# EAGLE design 282_Universal_Verteilerplatine_ALF_v1.0_2023-02_28 (EAGLE 9.6.2)
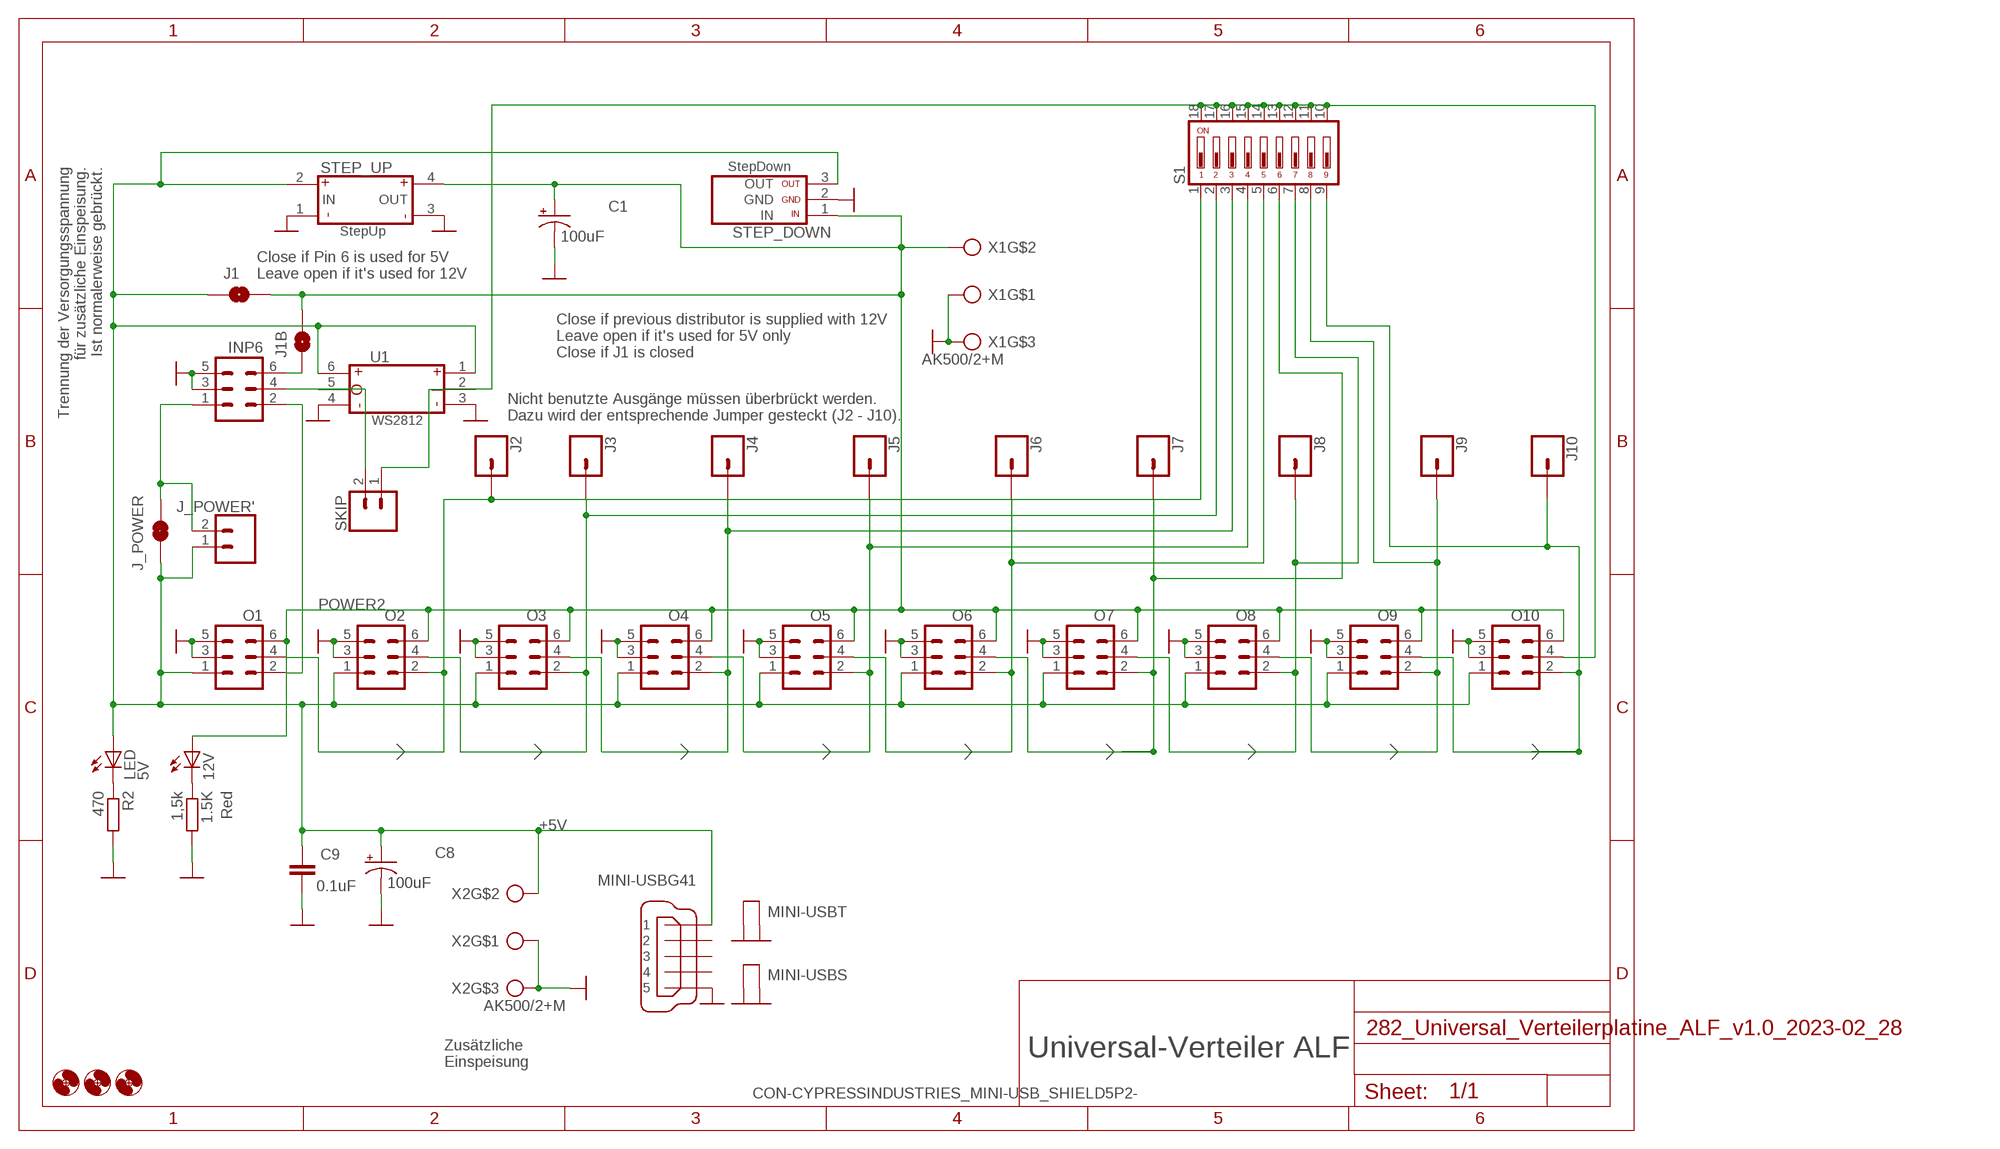
[diagram p0: schematic, sheet 1]

## Parts
1.5K  1,5k  RCL_R-EU_0207/7  [RCL_0207/7]
12V  Red  LED_LED3MM  [LED_LED3MM]
C1  100uF  SPARKFUN-CAPACITORS_100UF-25V-20%(PTH)  [SPARKFUN-CAPACITORS_CPOL-RADIAL-100UF-25V]
C8  100uF  SPARKFUN-CAPACITORS_100UF-25V-20%(PTH)  [SPARKFUN-CAPACITORS_CPOL-RADIAL-100UF-25V]
C9  0.1uF  C-EU025-025X050  [C025-025X050]
H5  MOUNT-HOLE3.0  [3,0]
H6  MOUNT-HOLE3.0  [3,0]
H8  MOUNT-HOLE3.0  [3,0]
INP6  ML6  [ML6]
J1  SOLDERJUMPERNO  [SJ_2S-NO]
J1B  SOLDERJUMPERNO  [SJ_2S-NO]
J2  CONN_01_NO_BORDER  [1X01_NO_BORDER]
J3  CONN_01_NO_BORDER  [1X01_NO_BORDER]
J4  CONN_01_NO_BORDER  [1X01_NO_BORDER]
J5  CONN_01_NO_BORDER  [1X01_NO_BORDER]
J6  CONN_01_NO_BORDER  [1X01_NO_BORDER]
J7  CONN_01_NO_BORDER  [1X01_NO_BORDER]
J8  CONN_01_NO_BORDER  [1X01_NO_BORDER]
J9  CONN_01_NO_BORDER  [1X01_NO_BORDER]
J10  CONN_01_NO_BORDER  [1X01_NO_BORDER]
J_POWER  SOLDERJUMPERNO  [SJ_2S-NO]
J_POWER'  CONN_02  [1X02]
LED  5V  LED_LED3MM  [LED_LED3MM]
MINI-USB  CON-CYPRESSINDUSTRIES_MINI-USB_SHIELD5P2-  [MINI_USB_MULTI]
O1  ML6  [ML6]
O2  ML6  [ML6]
O3  ML6  [ML6]
O4  ML6  [ML6]
O5  ML6  [ML6]
O6  ML6  [ML6]
O7  ML6  [ML6]
O8  ML6  [ML6]
O9  ML6  [ML6]
O10  ML6  [ML6]
R2  470  RCL_R-EU_0207/7  [RCL_0207/7]
S1  DIP09YL  [DIP09YL]
SKIP  CONN_02  [1X02]
STEP_DOWN  STEP_DOWN  [MINI_STEP_DOWN]
STEP_UP  STEP_UP  [MINI_STEP_UP]
U1  WS2812_BREAKOUTCUT  [WS2812__BREAKOUT_CUT]
X1  AK500/2+M  [AK500/2+M]
X2  AK500/2+M  [AK500/2+M]

## Nets
5V: C8.1(+) C9.2 J1.1 J_POWER'.1 J_POWER.1 LED.A MINI-USB.1 O1.1 O2.1 O3.1 O4.1 O5.1 O6.1 O7.1 O8.1 O9.1 O10.1 STEP_DOWN.3(VDD_OUT) STEP_UP.2(VDD_IN) U1.1(VDD1) U1.6(VDD) X2.2
GND: 1.5K.2 C1.2(-) C8.2(-) C9.1 INP6.3 INP6.5 MINI-USB.5 MINI-USB.M1(S:S1) MINI-USB.M2(S:S2) MINI-USB.M3(T:S1) MINI-USB.M4(T:S2) O1.3 O1.5 O2.3 O2.5 O3.3 O3.5 O4.3 O4.5 O5.3 O5.5 O6.3 O6.5 O7.3 O7.5 O8.3 O8.5 O9.3 O9.5 O10.3 O10.5 R2.2 STEP_DOWN.2(GND) STEP_UP.1(GND_IN) STEP_UP.3(GND_OUT) U1.3(GND1) U1.4(GND) X1.1 X1.M X2.1 X2.M
N$1: 1.5K.1 12V.K(C)
N$2: J7.1 O6.4 O7.2 S1.6
N$3: INP6.2 O1.2
N$4: J8.1 O7.4 O8.2 S1.7
N$5: INP6.6 J1B.1
N$6: INP6.4 SKIP.2 U1.5(DO)
N$7: O10.4 S1.10 S1.11 S1.12 S1.13 S1.14 S1.15 S1.16 S1.17 S1.18 SKIP.1 U1.2(DIN)
N$8: J2.1 O1.4 O2.2 S1.1
N$9: INP6.1 J_POWER'.2 J_POWER.2
N$10: J10.1 O9.4 O10.2 S1.9
N$11: J3.1 O2.4 O3.2 S1.2
N$16: LED.K(C) R2.1
N$47: J4.1 O3.4 O4.2 S1.3
N$50: J5.1 O4.4 O5.2 S1.4
N$51: J6.1 O5.4 O6.2 S1.5
N$57: J9.1 O8.4 O9.2 S1.8
POWER2: 12V.A C1.1(+) J1.2 J1B.2 O1.6 O2.6 O3.6 O4.6 O5.6 O6.6 O7.6 O8.6 O9.6 O10.6 STEP_DOWN.1(VDD_IN) STEP_UP.4(VDD_OUT) X1.2
Unconnected: MINI-USB.2 MINI-USB.3 MINI-USB.4

## Notes on the sheet
- Trennung der Versorgungsspannung
  für zusätzliche Einspeisung.
  Ist normalerweise gebrückt.
- Close if Pin 6 is used for 5V
  Leave open if it's used for 12V
- Close if previous distributor is supplied with 12V
  Leave open if it's used for 5V only
  Close if J1 is closed
- Nicht benutzte Ausgänge müssen überbrückt werden.
  Dazu wird der entsprechende Jumper gesteckt (J2 - J10).
- +5V
- Zusätzliche
  Einspeisung
- Universal-Verteiler ALF

## Library data of the parts
1.5K R2 = Sound_MP3-TF-16P_and_WS2811:RCL_R-EU_: RESISTOR, European symbol; SPICEPREFIX: R
12V LED = Sound_MP3-TF-16P_and_WS2811:LED_LED: LED OSRAM: - CHIPLED LG R971, LG N971, LY N971, LG Q971, LY Q971, LO R971, LY R971 LH N974, LH R974 LS Q976, LO Q976, LY Q976 LO Q996 - Hyper CHIPLED LW Q18S LB Q993, LB Q99A, LB R99A - SideLED LS A670, LO A670, LY A670, LG A670, LP A670 LB A673, LV A673, LT A673, LW A673 LH A674 LY A675 LS A676, LA A676, LO A676, LY A676, LW A676 LS A679, LY A679, LG A679 - Hyper Micro SIDELED® LS Y876, LA Y876, LO Y876, LY Y876 LT Y87S - SmartLED LW L88C, LW L88S LB L89C, LB L89S, LG L890 LS L89K, LO L89K, LY L89K LS L896, LA L896, LO L896, LY L896 - TOPLED LS T670, LO T670, LY T670, LG T670, LP T670 LSG T670, LSP T670, LSY T670, LOP T670, LYG T670 LG T671, LOG T671, LSG T671 LB T673, LV T673, LT T673, LW T673 LH T674 LS T676, LA T676, LO T676, LY T676, LB T676, LH T676, LSB T676, LW T676 LB T67C, LV T67C, LT T67C, LS T67K, LO T67K, LY T67K, LW E67C LS E67B, LA E67B, LO E67B, LY E67B, LB E67C, LV E67C, LT E67C LW T67C LS T679, LY T679, LG T679 LS T770, LO T770, LY T770, LG T770, LP T770 LB T773, LV T773, LT T773, LW T773 LH T774 LS E675, LA E675, LY E675, LS T675 LS T776, LA T776, LO T776, LY T776, LB T776 LHGB T686 LT T68C, LB T68C - Hyper Mini TOPLED® LB M676 - Mini TOPLED Santana® LG M470 LS M47K, LO M47K, LY M47K Source: http://www.osram.convergy.de LUXEON: - LUMILED® LXK2-PW12-R00, LXK2-PW12-S00, LXK2-PW14-U00, LXK2-PW14-V00 LXK2-PM12-R00, LXK2-PM12-S00, LXK2-PM14-U00 LXK2-PE12-Q00, LXK2-PE12-R00, LXK2-PE12-S00, LXK2-PE14-T00, LXK2-PE14-U00 LXK2-PB12-K00, LXK2-PB12-L00, LXK2-PB12-M00, LXK2-PB14-N00, LXK2-PB14-P00, LXK2-PB14-Q00 LXK2-PR12-L00, LXK2-PR12-M00, LXK2-PR14-Q00, LXK2-PR14-R00 LXK2-PD12-Q00, LXK2-PD12-R00, LXK2-PD12-S00 LXK2-PH12-R00, LXK2-PH12-S00 LXK2-PL12-P00, LXK2-PL12-Q00, LXK2-PL12-R00 Source: www.luxeon.com KINGBRIGHT: KA-3528ASYC Source: www.kingbright.com
C1 C8 = Sound_MP3-TF-16P_and_WS2811:SPARKFUN-CAPACITORS_100UF-25V-20%(PTH): CAP-08439; PROD_ID: CAP-08439
C9 = rcl:C-EU: CAPACITOR, European symbol; SPICEPREFIX: C
H5 H6 H8 = holes:MOUNT-HOLE: MOUNTING HOLE with drill center marker
INP6 O1-O10 = con-harting-ml:ML6: HARTING; OC_FARNELL: unknown; OC_NEWARK: unknown
J1 J1B J_POWER = SparkFun-Retired:SOLDERJUMPER: Solder Jumper Standard SMD solder jumper. Used to automate production. Two varients : Normally Open and Normally Closed are the same, but have different paste layers. NC will have a large amount of paste and should jumper during reflow.
J2-J10 = SparkFun-Connectors:CONN_01: Single connection point. Often used as Generic Header-pin footprint for 0.1 inch spaced/style header connections On any of the 0.1 inch spaced packages, you can populate with these: Break Away Headers - Straight <https://www.sparkfun.com/products/116> (PRT-00116) Break Away Male Headers - Right Angle <https://www.sparkfun.com/products/553> (PRT-00553) Female Headers <https://www.sparkfun.com/products/115> (PRT-00115) Break Away Headers - Machine Pin <https://www.sparkfun.com/products/117> (PRT-00117) Break Away Female Headers - Swiss Machine Pin <https://www.sparkfun.com/products/743> (PRT-00743) This device is also useful as a general connection point to wire up your design to another part of your project. Our various solder wires solder well into these plated through hole pads. Hook-Up Wire - Assortment (Stranded, 22 AWG) <https://www.sparkfun.com/products/11375> (PRT-11375) Hook-Up Wire - Assortment (Solid Core, 22 AWG) <https://www.sparkfun.com/products/11367> (PRT-11367) View the entire wire category on our website here <https://www.sparkfun.com/categories/141> Special notes: SMTSO-256-ET is a "flush mount" nut for a 4-40 screw. We mostly use this on specialty testbeds; it is a nice way to connect hardware to your PCB at an adjustable hieght. Also note, the SNAP packages are for using a snappable style connector. We sell a baggie of snaps and they are also used on two LilyPad designs: Snap Assortment - 30 pack (male and female) <https://www.sparkfun.com/products/11347> (DEV-11347) LilyPad Arduino SimpleSnap <https://www.sparkfun.com/products/10941> (DEV-10941) LilyPad SimpleSnap Protoboard <https://www.sparkfun.com/products/10940> (DEV-10940)
J_POWER' SKIP = SparkFun-Connectors:CONN_02: Multi connection point. Often used as Generic Header-pin footprint for 0.1 inch spaced/style header connections On any of the 0.1 inch spaced packages, you can populate with these: Break Away Headers - Straight <https://www.sparkfun.com/products/116> (PRT-00116) Break Away Male Headers - Right Angle <https://www.sparkfun.com/products/553> (PRT-00553) Female Headers <https://www.sparkfun.com/products/115> (PRT-00115) Break Away Headers - Machine Pin <https://www.sparkfun.com/products/117> (PRT-00117) Break Away Female Headers - Swiss Machine Pin <https://www.sparkfun.com/products/743> (PRT-00743) For SCREWTERMINALS and SPRING TERMINALS visit here: Screw Terimnals on SparkFun.com <https://www.sparkfun.com/search/results?term=Screw+Terminals> (5mm/3.5mm/2.54mm spacing) This device is also useful as a general connection point to wire up your design to another part of your project. Our various solder wires solder well into these plated through hole pads. Hook-Up Wire - Assortment (Stranded, 22 AWG) <https://www.sparkfun.com/products/11375> (PRT-11375) Hook-Up Wire - Assortment (Solid Core, 22 AWG) <https://www.sparkfun.com/products/11367> (PRT-11367) View the entire wire category on our website here <https://www.sparkfun.com/categories/141> Special notes: Molex polarized connector foot print use with: PRT-08233 with associated crimp pins and housings. 2.54_SCREWTERM for use with PRT-10571. 3.5mm Screw Terminal footprints for PRT-08084 5mm Screw Terminal footprints for use with PRT-08432
MINI-USB = Mini-MLL_Plus_v0.2:CON-CYPRESSINDUSTRIES_MINI-USB_SHIELD5P2-: MINI USB-B R/A DIP 5pol. Source: www.cypressindustries.com
S1 = switch-dil:DIP09YL: DIL/CODE SWITCH; OC_FARNELL: unknown; OC_NEWARK: unknown
STEP_DOWN = Arduino_fuer_LEDs_DCC_2_All:STEP_DOWN
STEP_UP = Arduino_fuer_LEDs_DCC_2_All:STEP_UP
U1 = Arduino_fuer_LEDs_DCC_2_All:WS2812_BREAKOUT: WS2812 Modul mit Winkelsteckern (by Hardi) abgesägt
X1 X2 = Arduino_fuer_LEDs_DCC_2:AK500/2+M

## Board
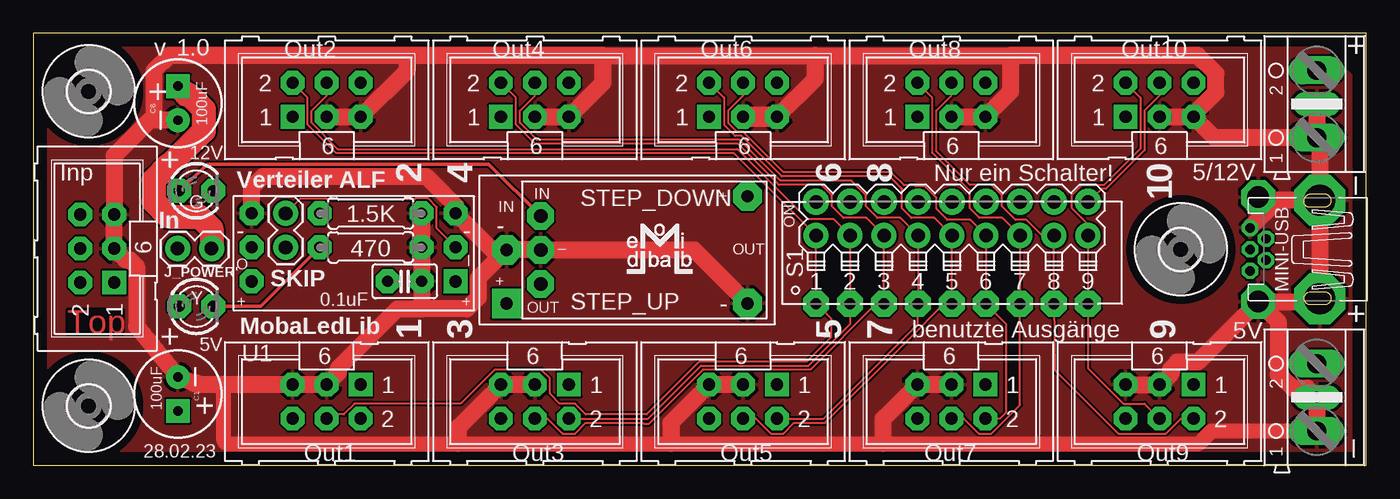
[diagram p1: board, top side]
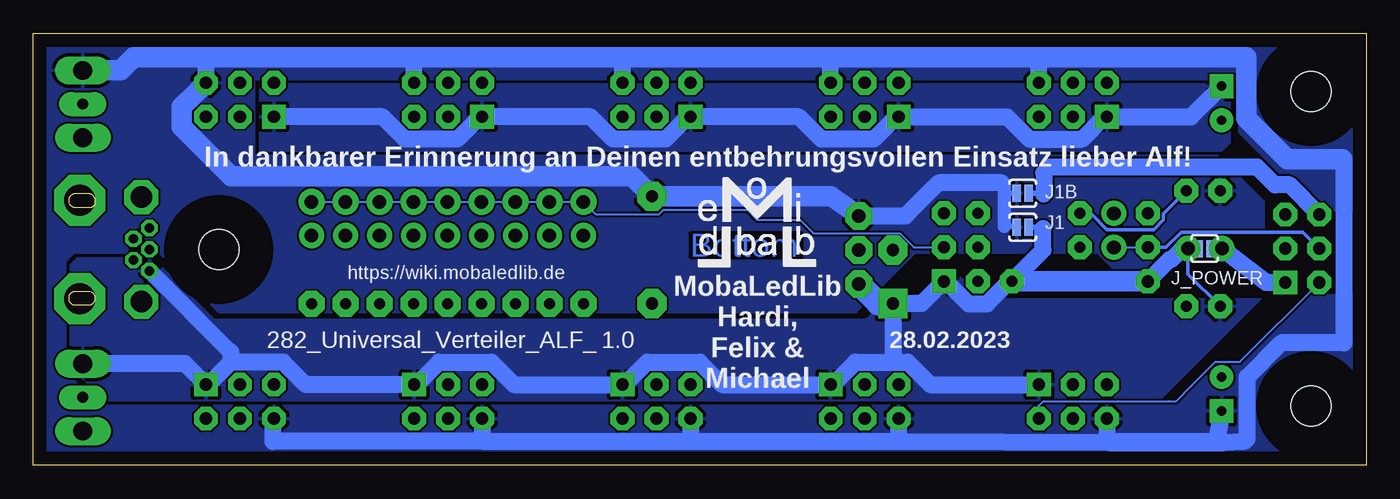
[diagram p2: board, bottom side, seen from below]

Size 99.57 x 32.26 mm. Coordinates in mm from the lower left corner, seen from the top.
Outline: 0,0 99.57,0 99.57,32.26 0,32.26 0,0
Copper layers (1*16): Top 0.035mm / dielectric 1.5mm / Bottom 0.035mm
Design rules "default *": minimum track width 6mil, minimum drill 0.35mm, track to track 6mil, track to pad 6mil, pad to pad 6mil, via to via 6mil, smd to smd 6mil, copper to edge 40mil, drill to drill 6mil, minimum pad ring 10mil, minimum via ring 8mil, stop-mask expansion 4mil, vias tented up to drill 0mil, thermal gap 10mil

### Footprints (pad centres in the part's own frame; a part is rotated, then mirrored left to right if it is on the bottom)
RCL_0207/7 = drill 0.813 pad 1.778 octagon: 1 -3.81,0; 2 3.81,0
LED_LED3MM = drill 0.813 pad 1.778 octagon: A -1.27,0; K 1.27,0
SPARKFUN-CAPACITORS_CPOL-RADIAL-100UF-25V = drill 0.7 pad 1.778 square: 1 1.27,0 | drill 0.7 pad 1.778: 2 -1.27,0
C025-025X050 = drill 0.813 pad 1.778 octagon: 1 -1.27,0; 2 1.27,0
3,0 = hole 3: 0,0
ML6 = drill 0.914 pad 1.778 square: 1 -2.54,-1.27 | drill 0.914 pad 1.778 octagon: 2 -2.54,1.27; 3 0,-1.27; 4 0,1.27; 5 2.54,-1.27; 6 2.54,1.27
SJ_2S-NO = smd 0.635 x 1.27: 1 -0.45,0; 2 0.45,0
1X01_NO_BORDER = drill 1.016 pad 1.88: 1 0,0
1X02 = drill 1.016 pad 1.88: 1 0,0; 2 2.54,0
MINI_USB_MULTI = drill 0.7 pad 1.143 octagon: 1 2.825,1.6; 2 1.625,0.8; 3 2.825,0; 4 1.625,-0.8; 5 2.825,-1.6 | drill 2.3 pad 3.81 octagon: M1 -2.375,3.675; M2 -2.375,-3.675 | drill 1.6 pad 2.54 octagon: M3 2.225,3.9; M4 2.225,-3.9
DIP09YL = drill 0.813 pad 1.93 octagon: 1 -10.16,-3.81; 2 -7.62,-3.81; 3 -5.08,-3.81; 4 -2.54,-3.81; 5 0,-3.81; 6 2.54,-3.81; 7 5.08,-3.81; 8 7.62,-3.81; 9 10.16,-3.81 | drill 1.016 pad 1.93: 10 10.16,3.81; 11 7.62,3.81; 12 5.08,3.81; 13 2.54,3.81; 14 0,3.81; 15 -2.54,3.81; 16 -5.08,3.81; 17 -7.62,3.81; 18 -10.16,3.81
MINI_STEP_DOWN = drill 1.016 pad 2.032 octagon: 1 0,2.54; 2 0,0; 3 0,-2.54
MINI_STEP_UP = drill 0.914 pad 2.184 octagon: 1 0,4; 3 18,0; 4 18,8 | drill 0.914 pad 2.184 square: 2 0,0
WS2812__BREAKOUT_CUT = drill 0.914 pad 1.778 square: 1 -7.62,2.54 | drill 0.914 pad 1.778 octagon: 2 -7.62,0; 3 -7.62,-2.54; 4 7.62,-2.54; 5 7.62,0; 6 7.62,2.54
AK500/2+M = drill 1.397 long: 1 -2.515,0; 2 2.515,0 | drill 0.813 pad 1.778 long: M 0,0

### Placement (x,y rotation side)
1.5K  25.2,18.82 0 top
12V  12.17,20.51 0 top
C1  10.79,5.33 270 top
C8  10.79,27.05 90 top
C9  27.74,13.74 180 top
H5  4.13,27.94 0 top
H6  4.13,4.45 0 top
H8  85.72,16.13 0 top
INP6  4.76,16.19 90 top
J1  25.65,17.78 180 bottom
J1B  25.65,20.32 180 bottom
J2  58.47,17.17 0 top
J3  61.01,17.17 0 top
J4  63.55,17.17 0 top
J5  66.09,17.17 0 top
J6  68.63,17.17 0 top
J7  71.17,17.17 0 top
J8  73.71,17.17 0 top
J9  76.25,17.17 0 top
J10  78.79,17.17 0 top
J_POWER  12.06,16.19 0 bottom
J_POWER'  13.31,16.19 180 top
LED  12.17,11.87 0 top
MINI-USB  93.73,16.13 180 top
O1  21.91,4.76 180 top
O2  21.91,27.3 0 top
O3  37.47,4.76 180 top
O4  37.47,27.3 0 top
O5  53.02,4.76 180 top
O6  53.02,27.3 0 top
O7  68.58,4.76 180 top
O8  68.58,27.3 0 top
O9  84.14,4.76 180 top
O10  84.14,27.3 0 top
R2  25.2,16.28 0 top
S1  68.63,15.88 0 top
SKIP  18.85,18.82 270 top
STEP_DOWN  37.9,16.09 0 top
STEP_UP  35.36,12.09 0 top
U1  23.93,16.28 180 top
X1  95.89,26.99 90 top
X2  95.89,5.08 90 top

### Tracks (layer width: path | path; a pad name or v marks a point on that pad's centre or on a via)
5V
  Top 1.778: C8.1 11.4,27.71 11.6,27.71 12.72,26.58 12.72,24.98 10.19,22.44 10.1,22.44 8.97,21.31 8.97,19.71 10.1,18.58 12.41,18.58 13.31,17.68 J_POWER'.1
  Bottom 0.152: J_POWER.1 J_POWER'.1
  Bottom 0.203: 25.15,17.78 J1.1
  Bottom 0.254: J_POWER'.1 13.31,14.29 LED.A
  Bottom 0.406: 24.13,17.68 24.23,17.78 25.15,17.78
  Bottom 1.219: MINI-USB.1 84.83,8.46
  Bottom 1.27: 84.83,7.71 80.9,7.71 79.23,6.03 O7.1 70.95,6.03 69.27,7.71 65.35,7.71 63.67,6.03 O5.1 55.39,6.03 53.72,7.71 49.79,7.71 48.11,6.03 O3.1 39.84,6.03 38.16,7.71 35.36,7.71 | O1.1 32.55,6.03 34.23,7.71 35.36,7.71 | O10.1 73.49,26.04 71.81,24.36 67.89,24.36 66.21,26.04 O8.1 57.93,26.04 56.26,24.36 52.33,24.36 50.65,26.04 O6.1 42.38,26.04 40.7,24.36 36.77,24.36 35.09,26.04 O4.1 26.82,26.04 25.14,24.36 21.21,24.36 19.54,26.04 O2.1 13.08,26.04 C8.1 | 35.36,7.71 STEP_UP.2 33.2,12.09 U1.1 31.38,13.74 29.7,12.06 28.31,12.06 26.64,13.74 C9.2 | 84.83,8.46 84.83,7.71 | 26.18,13.74 C9.2 | X2.2 88.24,7.59 O9.1 86.51,6.03 84.83,7.71 | C9.2 24.13,16.08 24.13,17.68 | U1.6 14.68,15.37 14.57,15.37 13.74,16.19 J_POWER'.1
  Bottom 1.524: U1.6 26.18,13.74
  Bottom 1.778: STEP_DOWN.3 36.44,12.09 STEP_UP.2
  pour Bottom: 10.16,28.45 82.68,28.45 82.68,23.5 10.79,23.5 10.16,24.13
  pour Bottom: 96.77,14.99 96.27,15.49 90.68,15.49 86.11,10.92 37.34,10.92 35.56,12.7 33.27,12.7 31.24,14.73 30.99,14.73 29.97,13.72 29.97,12.7 29.46,12.19 27.43,12.19 27.18,12.45 7.87,12.45 15.49,4.83 94.23,4.83 96.77,7.37
GND
  Top 0.152: 31.75,1.59 31.75,1.65 | 47.62,1.65 47.62,1.59 | 63.5,1.59 63.5,1.65
  Top 1.118: X2.1 88.01,2.56 87.04,1.59 63.5,1.59 47.62,1.59 31.75,1.59 14.49,1.59 14.22,1.85 14.22,6.03
  Top 1.27: O2.3 O2.5 27.94,29.53 27.94,30.61 | O4.3 O4.5 42.55,28.57 42.55,30.61 | O8.3 O8.5 73.03,27.94 73.03,30.61 | O10.3 O10.5 | O9.5 O9.3 85,6.9 85,7.25 85.46,7.71 86.98,7.71 MINI-USB.M3 | O7.3 O7.5 63.5,3.49 63.5,1.65 | O5.3 O5.5 47.62,3.17 47.62,1.65 | O3.3 O3.5 31.75,2.86 31.75,1.65 | 73.03,30.61 87.02,30.61 88.35,29.27 88.35,27.88 86.68,26.2 O10.5 | 42.55,30.61 27.94,30.61 | STEP_UP.1 STEP_DOWN.2 49.36,16.09 STEP_UP.3 | STEP_UP.1 34.28,16.09 U1.3 31.55,19.38 29.34,21.59 17.14,21.59 16.31,20.75 U1.4 | R2.2 1.5K.2 C9.1 29.01,11.68 | 27.94,30.61 10.13,30.61 8.98,29.47 8.98,26.07 8.7,25.78 | X1.M X1.1 | X1.1 88.24,24.47 O10.5 | X1.1 96.1,24.26 MINI-USB.M2 | MINI-USB.M2 MINI-USB.M1 95.88,12.23 MINI-USB.M3 | MINI-USB.M2 92.98,19.8 | 92.98,19.8 91.73,19.8 MINI-USB.M4 | MINI-USB.5 92.98,19.8 | MINI-USB.M3 93,10.73 93,6.83 94.08,5.76 95.21,5.76 X2.M X2.1 | 42.55,30.61 58.42,30.61 | 58.42,30.61 73.03,30.61 | O6.5 58.42,28.89 58.42,30.61 | 8.7,25.78 6.03,23.11 INP6.5 INP6.3 6.9,15.33 7.25,15.33 7.71,14.87 7.71,10.39 C1.2 11.98,6.12 12.33,6.12 12.42,6.03 14.22,6.03 O1.5 O1.3 22.77,6.9 22.77,7.25 27.21,11.68 29.01,11.68 | C8.2 8.7,25.78 | STEP_UP.1 33.22,13.96 33.22,12.53 32.38,11.68 29.01,11.68
  Top 1.524: O6.3 O6.5
  pour Top: 0,0 0,31.75 0,32.38 95.25,32.38 99.69,27.94 99.69,0
N$1
  Bottom 0.254: 1.5K.1 20.57,18.82 19.35,17.6 15.87,17.6 15.14,18.34 15.14,18.81 12V.K
N$2
  Top 0.152: O6.4 53.02,27.62 51.91,26.5 51.91,25.57 52.56,24.92 53.02,24.92 56.04,21.89 64.08,21.89 65.02,20.95 65.79,20.95 65.86,20.88 66.58,20.88 67.44,20.03 67.44,19.19 68.29,18.34 70,18.34 J7.1 S1.6 72.64,10.59 72.64,3.94 72.2,3.49 O7.2
N$3
  Bottom 0.152: O1.2 24.45,4.45 24.1,4.8 18.54,4.8 | INP6.2 9.42,7.72 11.26,7.72 13.05,5.93 | 18.54,4.8 14.73,4.8 | 14.73,4.8 14.18,4.8 13.05,5.93 | 13.05,5.93 | 14.73,4.8 | 18.54,4.8
N$4
  Top 0.152: O8.2 67.16,27.46 67.16,23.34 69.98,20.52 69.98,19.19 70.68,18.49 72,18.49 72.01,18.49 72.39,18.49 J8.1 S1.7 73.71,4.5 71.58,2.38 70.66,2.38 69.54,3.49 O7.4
N$5
  Bottom 0.203: 24.38,20.32 24.14,20.32 24.09,20.27
  Bottom 0.406: J1B.1 24.38,20.32
  Bottom 1.27: INP6.6 5.71,20.95 6.81,20.95 8.13,22.28 23.65,22.28 24.09,21.84 24.09,20.27
N$6
  Bottom 0.152: SKIP.2 U1.5
  Bottom 0.254: U1.5 14.95,16.28 13.81,17.41 4.71,17.41 INP6.4
N$7
  Top 0.152: O10.4 84.14,27.62 83.02,26.5 83.02,23.53 80.14,20.65 79.82,20.65 S1.10 | U1.2 30.12,17.7 30.12,19.28 29.47,19.94 28.54,19.94 28.52,19.91 21.88,19.91 21.85,19.94 19.96,19.94 SKIP.1
  Bottom 0.152: S1.10 S1.11 S1.12 S1.13 S1.14 S1.15 S1.16 S1.17 S1.18 57.55,18.77 52.81,18.77 52.51,19.07 46.23,19.07 45.5,18.35 42.31,18.35 41.3,17.34 34.84,17.34 33.79,16.28 U1.2
N$8
  Top 0.152: O2.2 20.48,27.46 20.48,25.45 22.61,23.32 52.32,23.32 J2.1 S1.1 59.62,10.96 59.62,9.59 57.79,7.76 49.77,7.76 45.82,3.81 41.27,3.81 40.47,4.61 39.33,4.61 38.58,5.35 38.58,6.5 37.93,7.15 34.46,7.15 31.92,4.61 23.98,4.61 23.18,3.81 22.23,3.81 O1.4
N$9
  Bottom 0.152: J_POWER.2 10.94,16.19 10.93,16.21
  Bottom 0.203: 10.93,16.21 J_POWER'.2
  Bottom 1.27: INP6.1 7.47,13.65 J_POWER'.2
N$10
  Top 0.152: O9.4 83.02,4.61 81.44,4.61 78.79,7.26 S1.9 J10.1 78.79,18 77.6,19.19 77.6,20.18 78.37,20.95 80.01,20.95 82.72,23.66 82.72,27.46 O10.2
N$11
  Top 0.152: O3.2 45.93,3.49 49.89,7.46 57.91,7.46 61.01,10.55 S1.2 J3.1 59.77,18.41 57.8,18.41 52.59,23.62 22.74,23.62 20.79,25.57 20.79,26.5 21.91,27.62 O2.4
N$16
  Top 0.254: LED.K 16.98,11.87 R2.1
N$47
  Top 0.152: O4.2 36.04,27.46 36.04,25.45 37.48,24 52.64,24 55.69,20.95 58.89,20.95 59.66,20.18 59.66,19.34 60.52,18.49 62.23,18.49 J4.1 S1.3 62.95,12.06 58.04,7.15 50.02,7.15 45.99,3.12 45.59,3.12 45.54,3.17 41.27,3.17 40.47,2.38 39.54,2.38 38.42,3.49 O3.4
N$50
  Top 0.152: O5.2 59.03,3.49 65.23,9.7 66.09,10.57 S1.4 J5.1 64.77,18.49 63.06,18.49 62.2,19.34 62.2,20.18 61.12,21.26 55.82,21.26 52.77,24.31 37.61,24.31 36.35,25.57 36.35,26.5 37.47,27.62 O4.4
N$51
  Top 0.152: O6.2 51.6,27.46 51.6,25.45 52.43,24.61 52.89,24.61 55.92,21.59 63.96,21.59 64.9,20.65 64.9,19.19 65.6,18.49 67.31,18.49 J6.1 S1.5 68.55,11.98 67.95,11.98 65.36,9.39 59.14,3.17 56.83,3.17 56.02,2.38 55.1,2.38 53.98,3.49 O5.4
N$57
  Top 0.152: O8.4 68.58,27.62 67.46,26.5 67.46,23.46 69.97,20.95 71.59,20.95 72.36,20.18 72.36,19.34 73.37,18.34 74.19,18.34 75.36,17.17 J9.1 S1.8 76.33,7.11 81.06,2.38 84.6,2.38 85.72,3.49 O9.2
POWER2
  Top 0.254: STEP_DOWN.1 34.02,22.5 13.03,22.5 12V.A
  Bottom 0.406: J1.2 26.18,17.86 27.03,17.86 | J1B.2 27.03,20.32
  Bottom 1.016: 27.03,17.86 27.03,20.32 27.03,20.9 27.23,21.11
  Bottom 1.27: STEP_DOWN.1 34.41,18.63 31.94,21.11 27.23,21.11 | 66.04,1.82 50.16,1.82 | 50.16,1.82 34.92,1.82 | O7.6 66.04,1.82 | O5.6 50.48,2.13 50.16,1.82 | O3.6 34.92,1.82 | 34.92,1.82 19.05,1.71 19.37,2.13 O1.6 | 66.04,1.82 81.62,1.82 81.66,1.78 81.66,3.43 O9.6 | C1.1 11.11,2.13 10.79,1.71 9.05,1.82 8.89,1.98 8.89,6.58 6.33,9.14 1.65,9.14 1.65,22.73 1.78,22.86 | O2.6 24.45,30.16 24.13,30.48 | O4.6 40.01,30.48 | O6.6 55.56,30.16 55.88,30.48 | O8.6 71.12,30.48 | O10.6 86.68,30.16 87,30.48
  Bottom 1.372: 19.05,1.71 10.79,1.71
  Bottom 1.524: X1.2 93.05,29.5 92.08,30.48 87,30.48 71.12,30.48 55.88,30.48 40.01,30.48 24.13,30.48 8.95,30.48 8.95,25.94 5.87,22.86 1.78,22.86 | STEP_DOWN.1 39.99,20.09 STEP_UP.4 54.86,21.59 84.78,21.59 88.48,25.29 88.48,26.78 87.42,27.84 87.41,27.84 O10.6
  pour Bottom: 0,19.05 0,29.84 2.54,32.38 99.69,32.38 99.69,0 0,0 0,12.7 5.71,12.7 6.03,12.38 7.18,12.38 15.11,4.45 94.61,4.45 97.16,6.99 97.16,15.24 96.52,15.88 90.17,15.88 85.72,11.43 38.1,11.43 33.66,15.88 20.07,15.88 17.14,12.95 9.02,12.95 7.62,14.35 7.62,19.68 11.05,23.11 83.06,23.11 83.06,28.83 9.78,28.83 9.53,28.57 9.53,24.89 3.68,19.05

### Text on the board
Top: Top
Bottom: Bottom
tPlace: v | + | Nur ein Schalter! | + | 5/12V | IN | OUT | benutzte Ausgänge | + | 5V | 100uF | + | 28.02.23
bPlace: https://wiki.mobaledlib.de
tNames: Out2 | Out4 | Out6 | Out8 | Out10 | + | Inp | Verteiler ALF | 2 | 4 | 6 | 8 | 0 | 1 | G | – | In | Y | 0.1uF | MobaLedLib | 1 | 3 | 5 | 7 | 9 | + | Out1 | Out3 | Out5 | Out7 | Out9 | –
bNames: In dankbarer Erinnerung an Deinen entbehrungsvollen Einsatz lieber Alf! | MobaLedLib | 282_Universal_Verteiler_ALF_ | Hardi, / Felix & / Michael